# Altium schematic sheet core.SchDoc
size A3
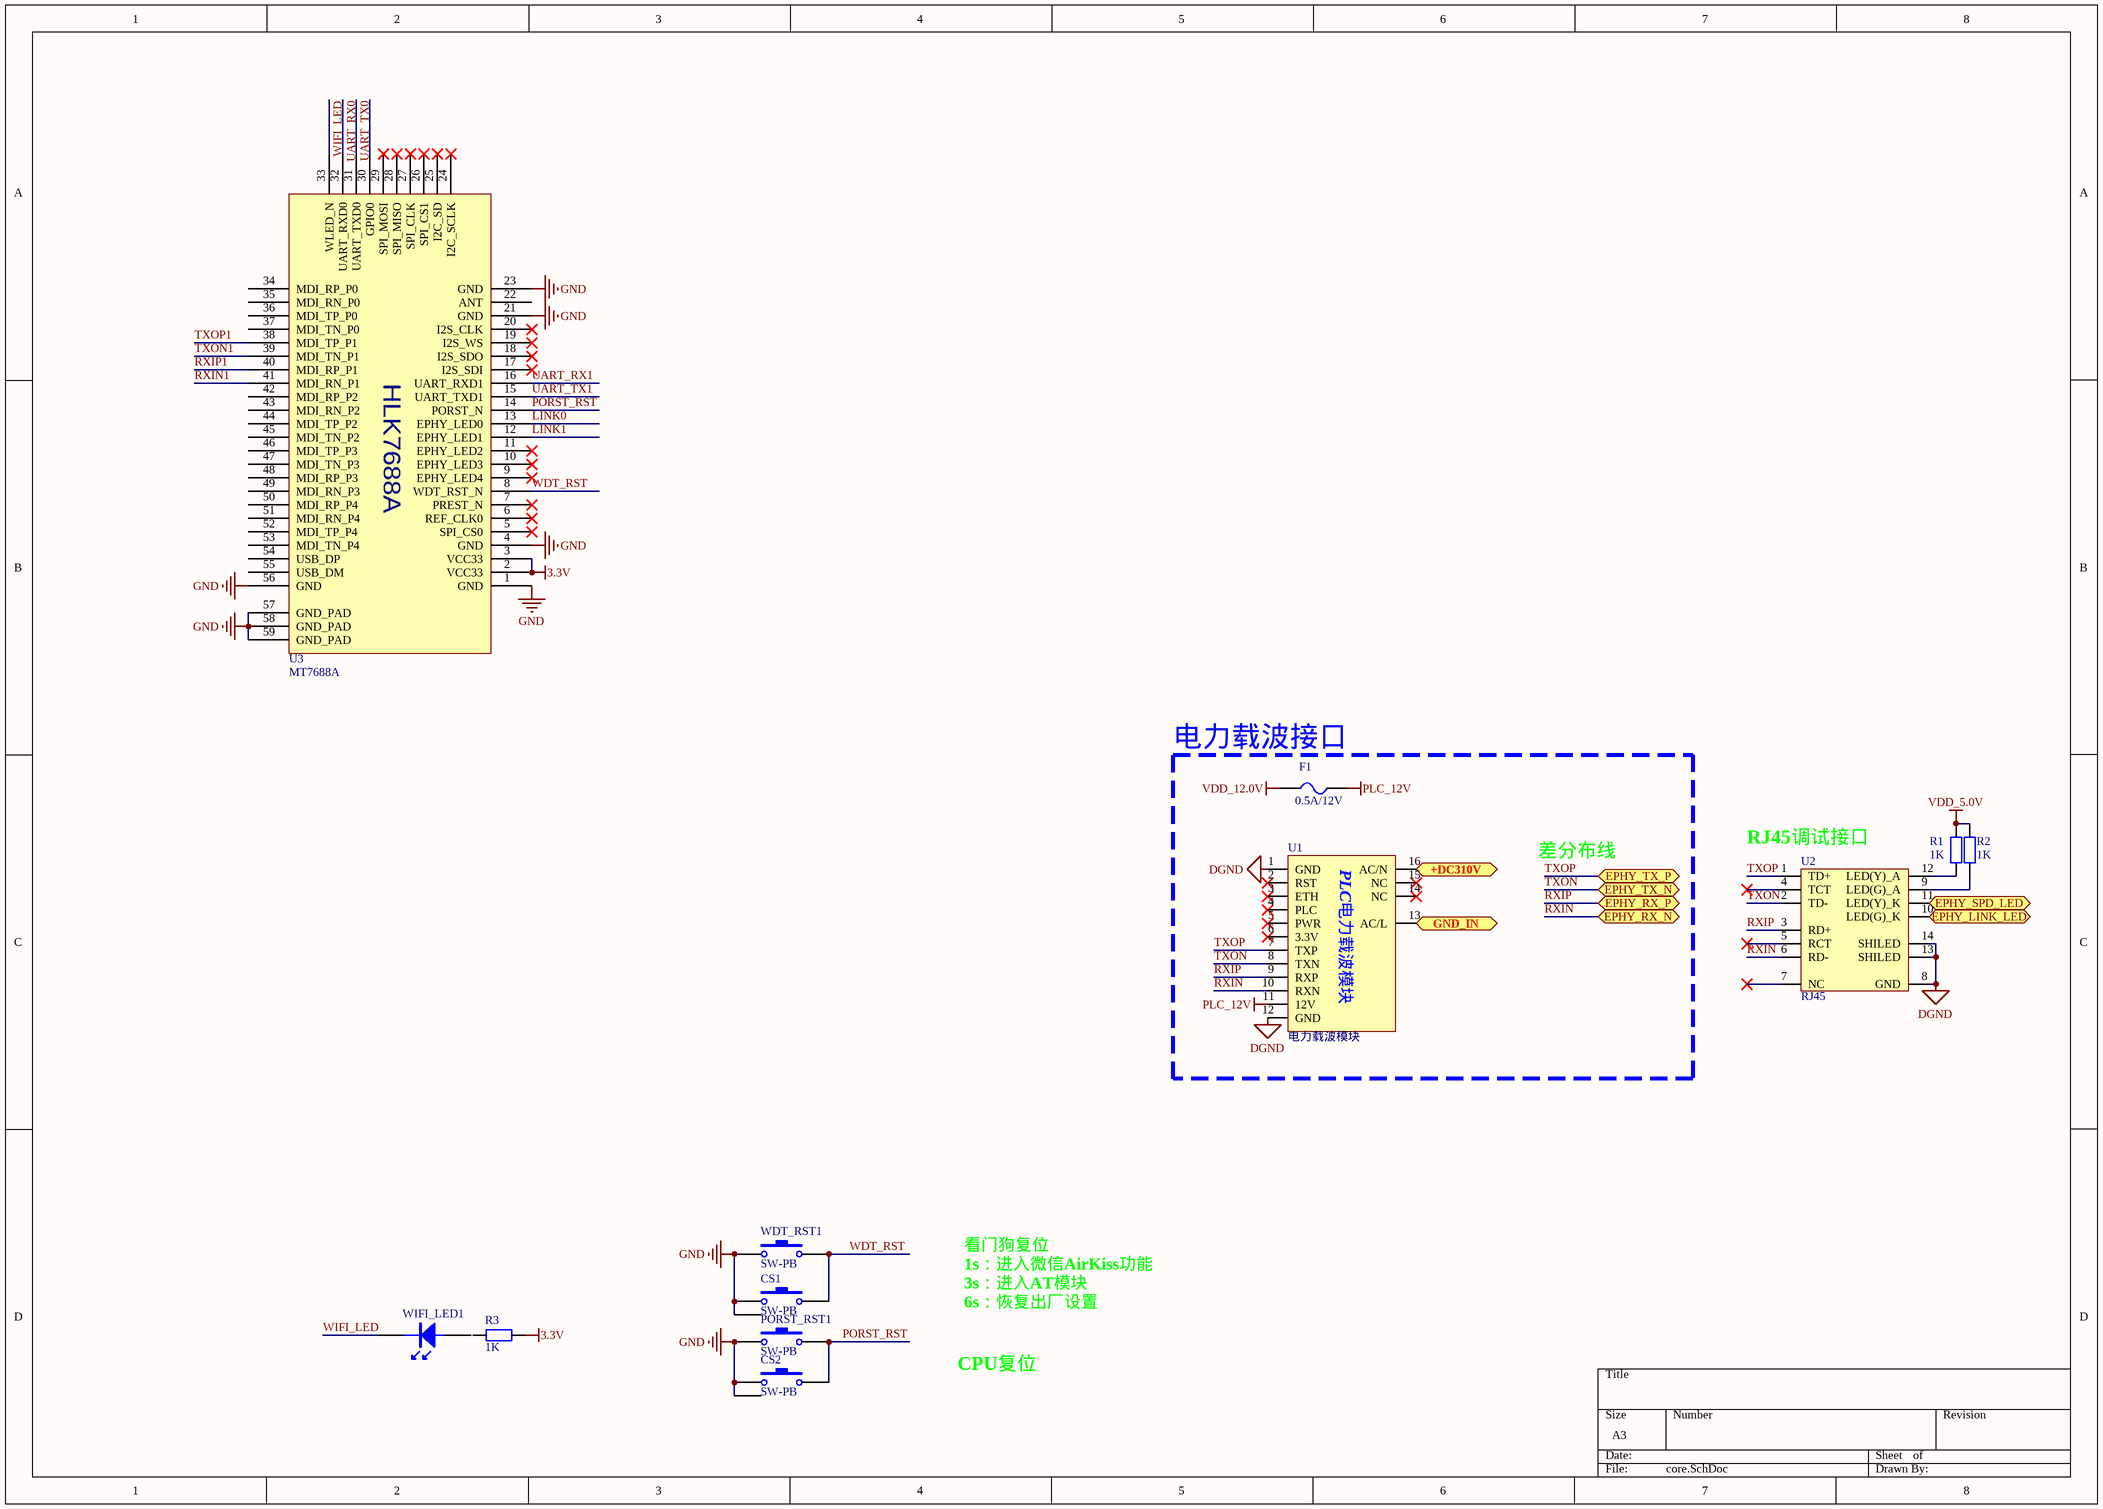
[diagram p0: core.SchDoc]

## Parts
CS1  SW-PB  [K5]
CS2  SW-PB  [K5]
F1  0.5A/12V  [1206F]
PORST_RST1  SW-PB  [SWITCH]
R1  1K  [0805R]
R2  1K  [0805R]
R3  1K  [0805R]
U1  电力载波模块  [电力载波模块6410（贴片排母）]
U2  RJ45  [RJ45]
U3  MT7688A  [MT7688A]
WDT_RST1  SW-PB  [SWITCH]
WIFI_LED1  (no value)  [0603LED]

## Blocks framed on the sheet
电力载波接口: F1 U1

## Ports
+DC310V, EPHY_LINK_LED, EPHY_RX_N, EPHY_RX_P, EPHY_SPD_LED, EPHY_TX_N, EPHY_TX_P, GND_IN

## Nets
3.3V: R3.2 U3.2(VCC33) U3.3(VCC33)
DGND: U1.1(GND) U1.12(GND) U2.8(GND) U2.13(SHILED) U2.14(SHILED)
GND: CS1.1 CS1.3 CS2.1 CS2.3 PORST_RST1.1 U3.1(GND) U3.4(GND) U3.21(GND) U3.23(GND) U3.56(GND) U3.57(GND_PAD) U3.58(GND_PAD) U3.59(GND_PAD) WDT_RST1.1
PLC_12V: F1.2 U1.11(12V)
VDD_5.0V: R1.1 R2.1
VDD_12.0V: F1.1
+DC310V: U1.16(AC/N) ; port +DC310V
EPHY_LINK_LED: U2.10(LED(G)_K) ; port EPHY_LINK_LED
EPHY_SPD_LED: U2.11(LED(Y)_K) ; port EPHY_SPD_LED
GND_IN: U1.13(AC/L) ; port GND_IN
LINK0: U3.13(EPHY_LED0)
LINK1: U3.12(EPHY_LED1)
PORST_RST: CS2.2 PORST_RST1.2 U3.14(PORST_N)
RXIN: U1.10(RXN) U2.6(RD-) ; port EPHY_RX_N
RXIN1: U3.41(MDI_RN_P1)
RXIP: U1.9(RXP) U2.3(RD+) ; port EPHY_RX_P
RXIP1: U3.40(MDI_RP_P1)
TXON: U1.8(TXN) U2.2(TD-) ; port EPHY_TX_N
TXON1: U3.39(MDI_TN_P1)
TXOP: U1.7(TXP) U2.1(TD+) ; port EPHY_TX_P
TXOP1: U3.38(MDI_TP_P1)
UART_RX0: U3.32(UART_RXD0)
UART_RX1: U3.16(UART_RXD1)
UART_TX0: U3.31(UART_TXD0)
UART_TX1: U3.15(UART_TXD1)
WDT_RST: CS1.2 U3.8(WDT_RST_N) WDT_RST1.2
WIFI_LED: U3.33(WLED_N) WIFI_LED1.2
NetR1_2: R1.2 U2.12(LED(Y)_A)
NetR2_2: R2.2 U2.9(LED(G)_A)

Not connected (* = marked no-connect by the designer): R3 1; U1 2(RST)* 3(ETH)* 4(PLC)* 5(PWR)* 6(3.3V)* 14(NC)* 15(NC)*; U2 4(TCT)* 5(RCT)* 7(NC)*; U3 5(SPI_CS0)* 6(REF_CLK0)* 7(PREST_N)* 9(EPHY_LED4)* 10(EPHY_LED3)* 11(EPHY_LED2)* 17(I2S_SDI)* 18(I2S_SDO)* 19(I2S_WS)* 20(I2S_CLK)* 22(ANT) 24(I2C_SCLK)* 25(I2C_SD)* 26(SPI_CS1)* 27(SPI_CLK)* 28(SPI_MISO)* 29(SPI_MOSI)* 30(GPIO0) 34(MDI_RP_P0) 35(MDI_RN_P0) 36(MDI_TP_P0) 37(MDI_TN_P0) 42(MDI_RP_P2) 43(MDI_RN_P2) 44(MDI_TP_P2) 45(MDI_TN_P2) 46(MDI_TP_P3) 47(MDI_TN_P3) 48(MDI_RP_P3) 49(MDI_RN_P3) 50(MDI_RP_P4) 51(MDI_RN_P4) 52(MDI_TP_P4) 53(MDI_TN_P4) 54(USB_DP) 55(USB_DM); WIFI_LED1 1

## Notes on the sheet
- 差分布线
- (near U2) RJ45调试接口
- 看门狗复位
  1s：进入微信AirKiss功能
  3s：进入AT模块
  6s：恢复出厂设置
- CPU复位
- (in symbol MT7688A) HLK7688A
- (in symbol 电力载波模块6410) PLC电力载波模块

## Library data of the parts
CS1 CS2 PORST_RST1 WDT_RST1 = SW-PB: Switch; Published: 24-Mar-1999; LatestRevisionDate: 17-Jul-2002; LatestRevisionNote: Re-released for DXP Platform.; PackageReference: SPST-2; Publisher: Altium Limited
F1 = Fuse: 保险丝
R1-R3 = Res: 电阻
U1 = 电力载波模块6410
U3 = MT7688A: MT7688A模组
WIFI_LED1 = LED